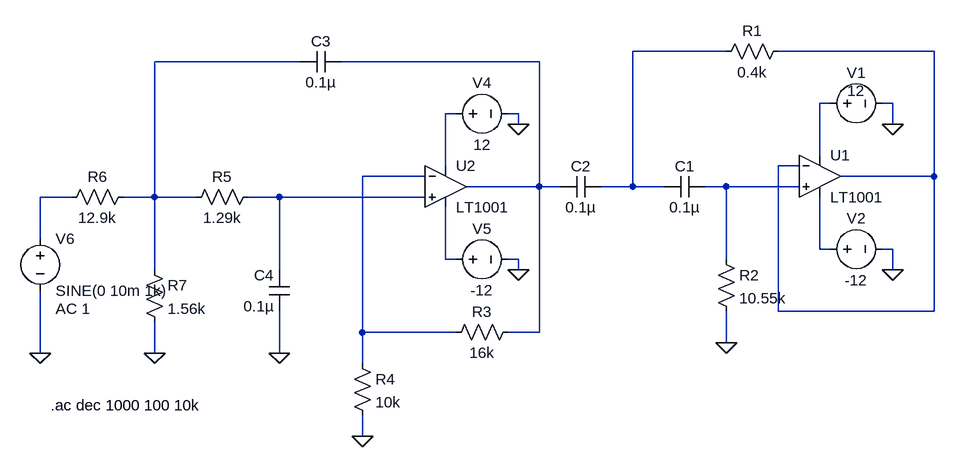
[diagram p0: schematic pasabanda.asc]
pasabanda.asc, the LTspice schematic file:
Version 4
SHEET 1 880 680
WIRE 48 -80 -96 -80
WIRE 368 -80 128 -80
WIRE -608 -64 -832 -64
WIRE -240 -64 -544 -64
WIRE 208 0 192 0
WIRE 304 0 288 0
WIRE -368 16 -384 16
WIRE -272 16 -288 16
WIRE -272 32 -272 16
WIRE 304 32 304 0
WIRE 192 80 192 0
WIRE -384 96 -384 16
WIRE 160 96 128 96
WIRE -416 112 -512 112
WIRE 368 112 368 -80
WIRE 368 112 224 112
WIRE -240 128 -240 -64
WIRE -240 128 -352 128
WIRE -208 128 -240 128
WIRE -96 128 -96 -80
WIRE -96 128 -144 128
WIRE -48 128 -96 128
WIRE 48 128 16 128
WIRE 160 128 48 128
WIRE -960 144 -1008 144
WIRE -832 144 -832 -64
WIRE -832 144 -880 144
WIRE -768 144 -832 144
WIRE -640 144 -688 144
WIRE -416 144 -640 144
WIRE -1008 208 -1008 144
WIRE 192 224 192 144
WIRE 208 224 192 224
WIRE 304 224 288 224
WIRE -384 240 -384 160
WIRE -368 240 -384 240
WIRE -272 240 -288 240
WIRE 48 240 48 128
WIRE -832 256 -832 144
WIRE -640 256 -640 144
WIRE -272 256 -272 240
WIRE 304 256 304 224
WIRE 128 320 128 96
WIRE 368 320 368 112
WIRE 368 320 128 320
WIRE -512 352 -512 112
WIRE -368 352 -512 352
WIRE -240 352 -240 128
WIRE -240 352 -288 352
WIRE 48 368 48 320
WIRE -1008 384 -1008 288
WIRE -832 384 -832 336
WIRE -640 384 -640 320
WIRE -512 400 -512 352
WIRE -512 512 -512 480
FLAG 304 32 0
FLAG 304 256 0
FLAG 48 368 0
FLAG -272 32 0
FLAG -272 256 0
FLAG -512 512 0
FLAG -640 384 0
FLAG -832 384 0
FLAG -1008 384 0
SYMBOL OpAmps\\LT1001 192 48 R0
SYMATTR InstName U1
SYMBOL voltage 192 0 R270
WINDOW 0 32 56 VTop 2
WINDOW 3 4 56 VTop 2
WINDOW 123 0 0 Left 0
WINDOW 39 0 0 Left 0
SYMATTR InstName V1
SYMATTR Value 12
SYMBOL voltage 192 224 R270
WINDOW 0 32 56 VTop 2
WINDOW 3 -32 56 VBottom 2
WINDOW 123 0 0 Left 0
WINDOW 39 0 0 Left 0
SYMATTR InstName V2
SYMATTR Value -12
SYMBOL res 144 -96 R90
WINDOW 0 0 56 VBottom 2
WINDOW 3 32 56 VTop 2
SYMATTR InstName R1
SYMATTR Value 0.4k
SYMBOL cap 16 112 R90
WINDOW 0 0 32 VBottom 2
WINDOW 3 32 32 VTop 2
SYMATTR InstName C1
SYMATTR Value 0.1µ
SYMBOL cap -144 112 R90
WINDOW 0 0 32 VBottom 2
WINDOW 3 32 32 VTop 2
SYMATTR InstName C2
SYMATTR Value 0.1µ
SYMBOL res 32 224 R0
SYMATTR InstName R2
SYMATTR Value 10.55k
SYMBOL OpAmps\\LT1001 -384 64 R0
SYMATTR InstName U2
SYMBOL cap -544 -80 R90
WINDOW 0 0 32 VBottom 2
WINDOW 3 32 32 VTop 2
SYMATTR InstName C3
SYMATTR Value 0.1µ
SYMBOL voltage -384 16 R270
WINDOW 0 32 56 VTop 2
WINDOW 3 -32 56 VBottom 2
WINDOW 123 0 0 Left 0
WINDOW 39 0 0 Left 0
SYMATTR InstName V4
SYMATTR Value 12
SYMBOL voltage -384 240 R270
WINDOW 0 32 56 VTop 2
WINDOW 3 -32 56 VBottom 2
WINDOW 123 0 0 Left 0
WINDOW 39 0 0 Left 0
SYMATTR InstName V5
SYMATTR Value -12
SYMBOL res -272 336 R90
WINDOW 0 0 56 VBottom 2
WINDOW 3 32 56 VTop 2
SYMATTR InstName R3
SYMATTR Value 16k
SYMBOL res -528 384 R0
SYMATTR InstName R4
SYMATTR Value 10k
SYMBOL cap -624 320 R180
WINDOW 0 24 56 Left 2
WINDOW 3 24 8 Left 2
SYMATTR InstName C4
SYMATTR Value 0.1µ
SYMBOL res -672 128 R90
WINDOW 0 0 56 VBottom 2
WINDOW 3 32 56 VTop 2
SYMATTR InstName R5
SYMATTR Value 1.29k
SYMBOL res -864 128 R90
WINDOW 0 0 56 VBottom 2
WINDOW 3 32 56 VTop 2
SYMATTR InstName R6
SYMATTR Value 12.9k
SYMBOL res -848 240 R0
SYMATTR InstName R7
SYMATTR Value 1.56k
SYMBOL voltage -1008 192 R0
WINDOW 123 24 124 Left 2
WINDOW 39 24 152 Left 2
SYMATTR Value2 AC 1
SYMATTR InstName V6
SYMATTR Value SINE(0 10m 1k)
TEXT -992 464 Left 2 !.ac dec 1000 100 10k

The netlist it stands for:
* pasabanda.asc
XU1 N008 N002 N005 N011 N002 LT1001  ; pins In+ In- V+ V- OUT
V1 N005 0 12
V2 N011 0 -12
R1 N002 N001 0.4k
C1 N008 N001 0.1µ
C2 N001 N004 0.1µ
R2 N008 0 10.55k
XU2 N010 N007 N006 N012 N004 LT1001  ; pins In+ In- V+ V- OUT
C3 N004 N003 0.1µ
V4 N006 0 12
V5 N012 0 -12
R3 N004 N007 16k
R4 N007 0 10k
C4 0 N010 0.1µ
R5 N010 N003 1.29k
R6 N003 N009 12.9k
R7 N003 0 1.56k
V6 N009 0 SINE(0 10m 1k) AC 1
.ac dec 1000 100 10k
.lib LTC.lib
.backanno
.end